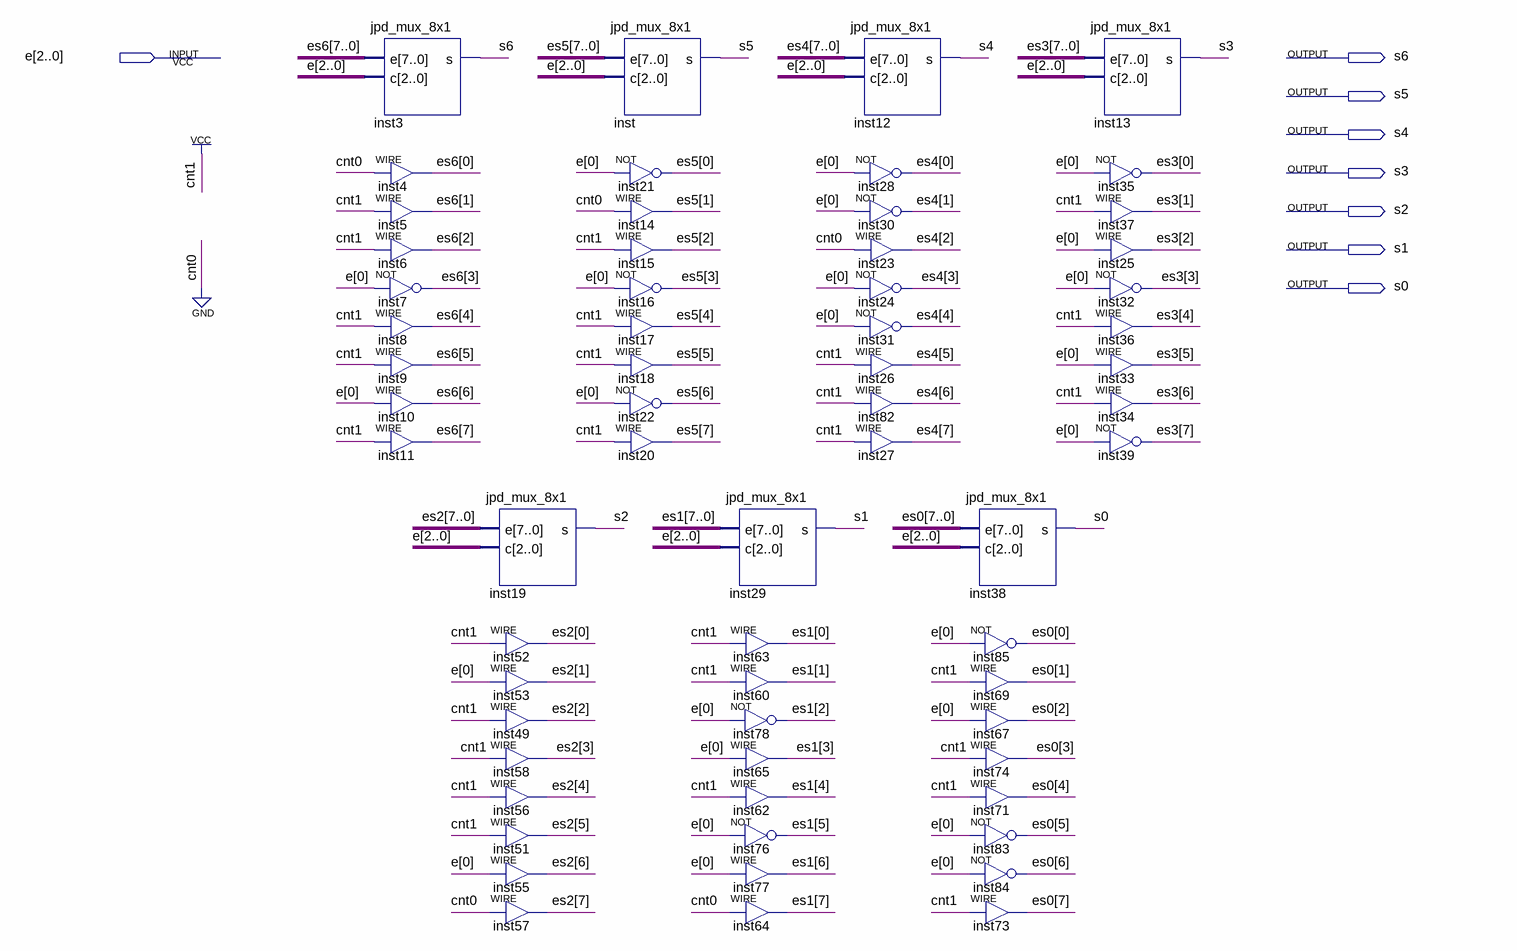
[diagram p0: schematic sheet]
// Quartus schematic jpd_display_7_seg_2.bdf as structural Verilog: 63 symbols, 8 pins
module jpd_display_7_seg_2 (
  input  [2:0] e,
  output s6,
  output s5,
  output s4,
  output s3,
  output s2,
  output s1,
  output s0
);

  wire [7:0] es0, es1, es2, es3, es4, es5, es6;

  jpd_mux_8x1 inst3 (.e(es6), .c(e), .s(s6));
  assign es6[0] = 1'b0;  // WIRE inst4
  assign es6[1] = 1'b1;  // WIRE inst5
  assign es6[2] = 1'b1;  // WIRE inst6
  not inst7 (es6[3], e[0]);
  assign es6[4] = 1'b1;  // WIRE inst8
  assign es6[5] = 1'b1;  // WIRE inst9
  assign es6[6] = e[0];  // WIRE inst10
  assign es6[7] = 1'b1;  // WIRE inst11
  jpd_mux_8x1 inst19 (.e(es2), .c(e), .s(s2));
  assign es2[0] = 1'b1;  // WIRE inst52
  assign es2[1] = e[0];  // WIRE inst53
  assign es2[2] = 1'b1;  // WIRE inst49
  assign es2[3] = 1'b1;  // WIRE inst58
  assign es2[4] = 1'b1;  // WIRE inst56
  assign es2[5] = 1'b1;  // WIRE inst51
  assign es2[6] = e[0];  // WIRE inst55
  assign es2[7] = 1'b0;  // WIRE inst57
  jpd_mux_8x1 inst (.e(es5), .c(e), .s(s5));
  not inst21 (es5[0], e[0]);
  assign es5[1] = 1'b0;  // WIRE inst14
  assign es5[2] = 1'b1;  // WIRE inst15
  not inst16 (es5[3], e[0]);
  assign es5[4] = 1'b1;  // WIRE inst17
  assign es5[5] = 1'b1;  // WIRE inst18
  not inst22 (es5[6], e[0]);
  assign es5[7] = 1'b1;  // WIRE inst20
  jpd_mux_8x1 inst29 (.e(es1), .c(e), .s(s1));
  assign es1[0] = 1'b1;  // WIRE inst63
  assign es1[1] = 1'b1;  // WIRE inst60
  not inst78 (es1[2], e[0]);
  assign es1[3] = e[0];  // WIRE inst65
  assign es1[4] = 1'b1;  // WIRE inst62
  not inst76 (es1[5], e[0]);
  assign es1[6] = e[0];  // WIRE inst77
  assign es1[7] = 1'b0;  // WIRE inst64
  jpd_mux_8x1 inst12 (.e(es4), .c(e), .s(s4));
  not inst28 (es4[0], e[0]);
  not inst30 (es4[1], e[0]);
  assign es4[2] = 1'b0;  // WIRE inst23
  not inst24 (es4[3], e[0]);
  not inst31 (es4[4], e[0]);
  assign es4[5] = 1'b1;  // WIRE inst26
  assign es4[6] = 1'b1;  // WIRE inst82
  assign es4[7] = 1'b1;  // WIRE inst27
  jpd_mux_8x1 inst38 (.e(es0), .c(e), .s(s0));
  not inst85 (es0[0], e[0]);
  assign es0[1] = 1'b1;  // WIRE inst69
  assign es0[2] = e[0];  // WIRE inst67
  assign es0[3] = 1'b1;  // WIRE inst74
  assign es0[4] = 1'b1;  // WIRE inst71
  not inst83 (es0[5], e[0]);
  not inst84 (es0[6], e[0]);
  assign es0[7] = 1'b1;  // WIRE inst73
  jpd_mux_8x1 inst13 (.e(es3), .c(e), .s(s3));
  not inst35 (es3[0], e[0]);
  assign es3[1] = 1'b1;  // WIRE inst37
  assign es3[2] = e[0];  // WIRE inst25
  not inst32 (es3[3], e[0]);
  assign es3[4] = 1'b1;  // WIRE inst36
  assign es3[5] = e[0];  // WIRE inst33
  assign es3[6] = 1'b1;  // WIRE inst34
  not inst39 (es3[7], e[0]);
endmodule
